# EAGLE design ArduPilot-v15 (EAGLE 5.04)

## Sheet 1 of 2
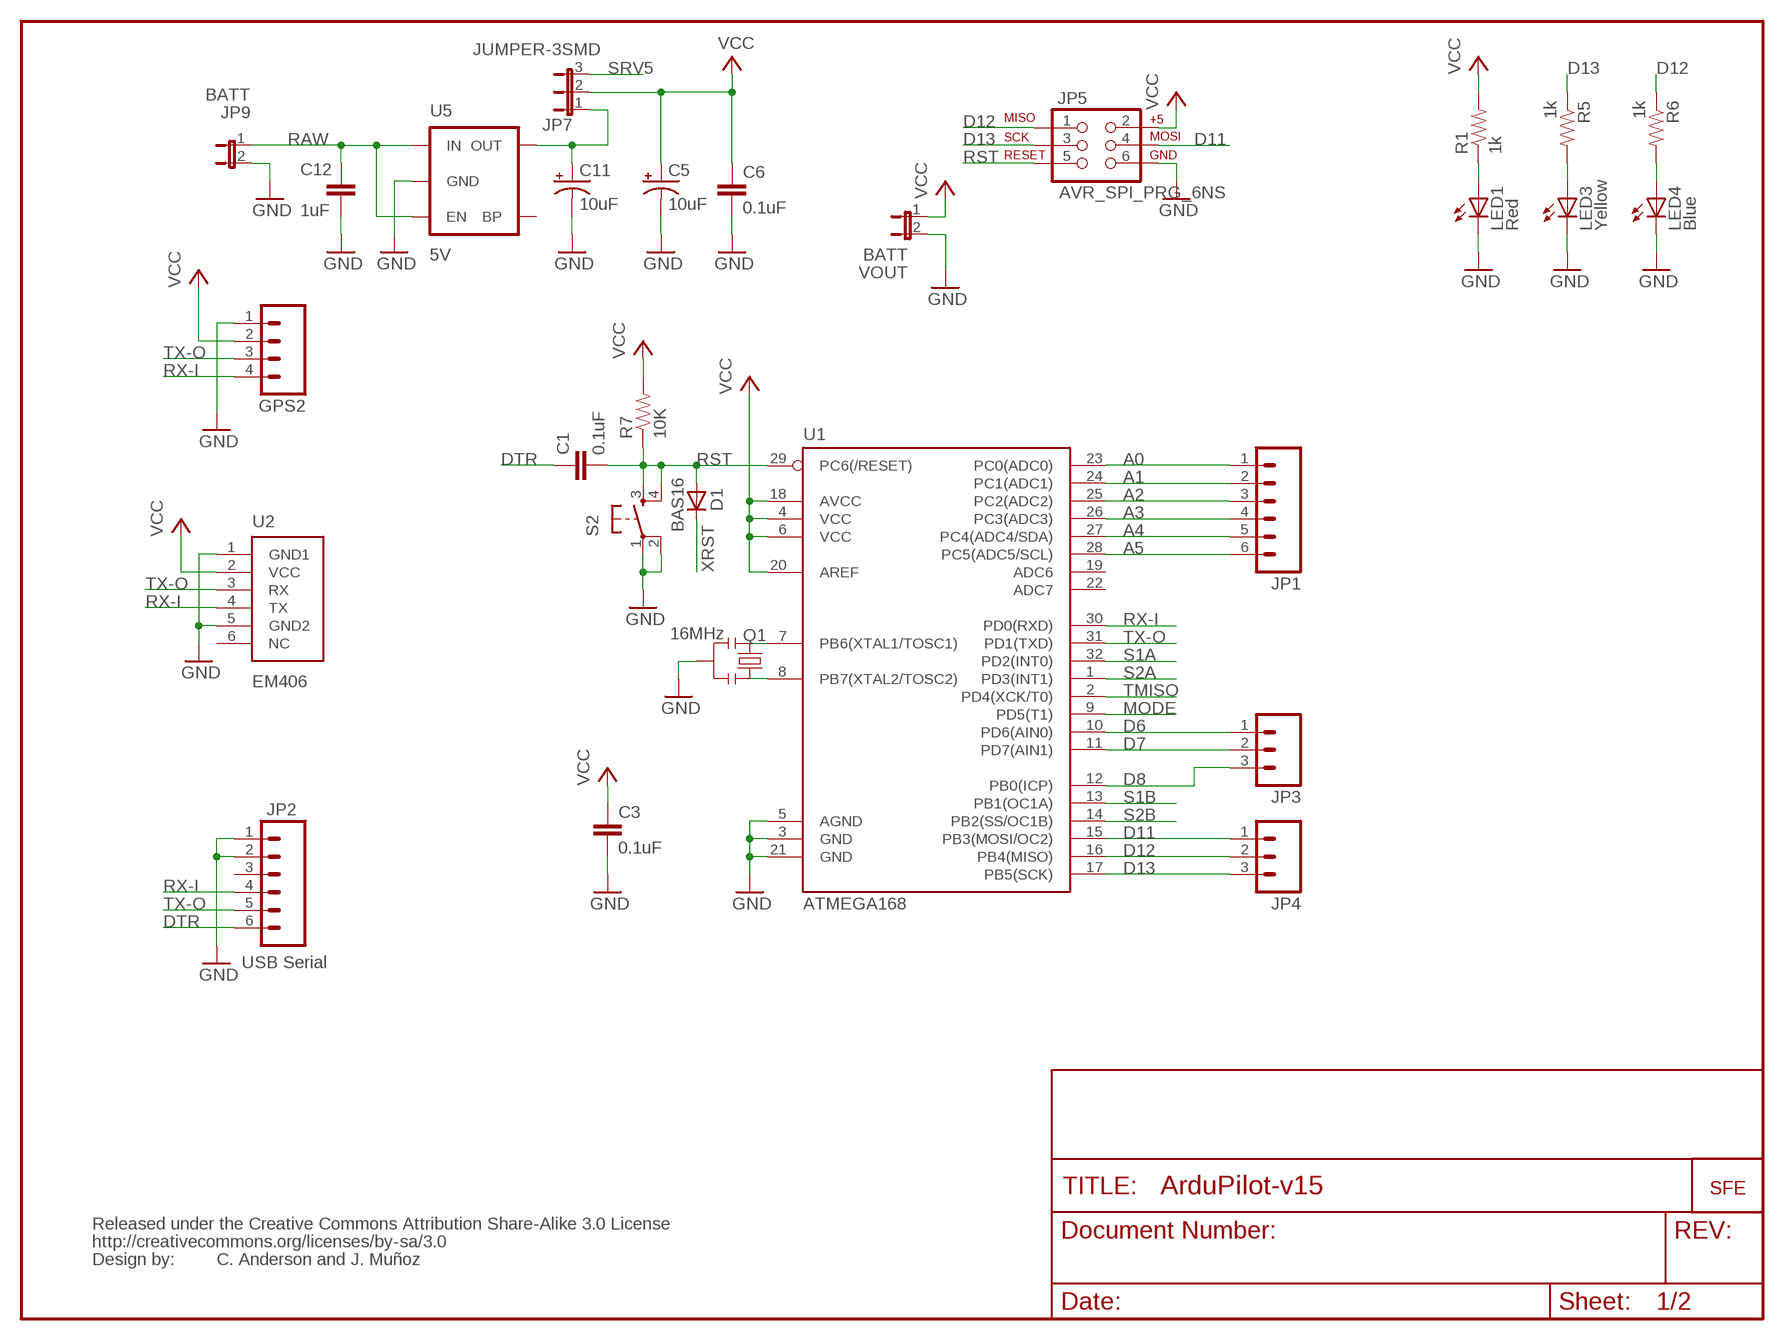
[diagram p0: schematic, sheet 1]

### Parts
C1  0.1uF  CAP0402  [C0402]
C3  0.1uF  CAP0402  [C0402]
C5  10uF  CAP_POL1206  [EIA3216]
C6  0.1uF  CAP0402  [C0402]
C11  10uF  CAP_POL1206  [EIA3216]
C12  1uF  CAP0402  [C0402]
D1  BAS16  DIODESOD  [SOD-323]
GPS2  M04PTH  [1X04]
JP1  M06SIP  [1X06]
JP2  USB Serial  M06SIP  [1X06]
JP3  M03PTH  [1X03]
JP4  M03PTH  [1X03]
JP5  AVR_SPI_PRG_6NS  [2X3-NS]
JP7  JUMPER-3SMD  [SJ_3]
JP9  BATT  JP1E  [1X02]
LED1  Red  LED0603  [LED-0603]
LED3  Yellow  LED0603  [LED-0603]
LED4  Blue  LED0603  [LED-0603]
Q1  16MHz  RESONATORSMD  [RESONATOR-SMD]
R1  1k  RESISTOR0402  [C0402]
R5  1k  RESISTOR0402  [C0402]
R6  1k  RESISTOR0402  [C0402]
R7  10K  RESISTOR0402  [C0402]
S2  TAC_SWITCHSMD  [TACTILE_SWITCH_SMD]
U1  ATMEGA168  [TQFP32-08]
U2  EM406  [EM406]
U5  5V  V_REG_LDOSMD  [SOT23-5]
U$1  LOGO-SFENEW  [SFE-NEW-WEBLOGO]
U$2  CREATIVE_COMMONS  [CREATIVE_COMMONS]
VOUT  BATT  JP1E  [1X02]

### Nets
A0: JP1.1 U1.23(PC0(ADC0))
A1: JP1.2 U1.24(PC1(ADC1))
A2: JP1.3 U1.25(PC2(ADC2))
A3: JP1.4 U1.26(PC3(ADC3))
A4: JP1.5 U1.27(PC4(ADC4/SDA))
A5: JP1.6 U1.28(PC5(ADC5/SCL))
D6: JP3.1 U1.10(PD6(AIN0))
D7: JP3.2 U1.11(PD7(AIN1))
D8: JP3.3 U1.12(PB0(ICP))
D11: JP4.1 JP5.4 U1.15(PB3(MOSI/OC2))
D12: JP4.2 JP5.1 R6.1 U1.16(PB4(MISO))
D13: JP4.3 JP5.3 R5.1 U1.17(PB5(SCK))
DTR: C1.1 JP2.6
GND: C3.2 C5.C(-) C6.2 C11.C(-) C12.2 GPS2.1 JP2.1 JP2.2 JP5.6 JP9.2 LED1.C LED3.C LED4.C Q1.2 S2.1 S2.2 U1.3(GND) U1.5(AGND) U1.21(GND) U2.1(GND1) U2.5(GND2) U5.2(GND) VOUT.2 ; also sheet 2
MODE: U1.9(PD5(T1)) ; also sheet 2
N$1: LED1.A R1.1
N$2: Q1.1 U1.7(PB6(XTAL1/TOSC1))
N$4: LED3.A R5.2
N$6: C11.A(+) JP7.1 U5.5(OUT)
N$8: LED4.A R6.2
N$9: Q1.3 U1.8(PB7(XTAL2/TOSC2))
RAW: C12.1 JP9.1 U5.1(IN) U5.3(EN)
RST: C1.2 D1.2(A) JP5.5 R7.1 S2.3 S2.4 U1.29(PC6(/RESET))
RX-I: GPS2.4 JP2.4 U1.30(PD0(RXD)) U2.4(TX)
S1A: U1.32(PD2(INT0)) ; also sheet 2
S1B: U1.13(PB1(OC1A)) ; also sheet 2
S2A: U1.1(PD3(INT1)) ; also sheet 2
S2B: U1.14(PB2(SS/OC1B)) ; also sheet 2
SRV5: JP7.3 ; also sheet 2
TMISO: U1.2(PD4(XCK/T0)) ; also sheet 2
TX-O: GPS2.3 JP2.5 U1.31(PD1(TXD)) U2.3(RX)
VCC: C3.1 C5.A(+) C6.1 GPS2.2 JP5.2 JP7.2 R1.2 R7.2 U1.4(VCC) U1.6(VCC) U1.18(AVCC) U1.20(AREF) U2.2(VCC) VOUT.1 ; also sheet 2
XRST: D1.1(C) ; also sheet 2
Unconnected: JP2.3 U1.19(ADC6) U1.22(ADC7) U2.6(NC) U5.4(BP)

### Notes on the sheet
- C. Anderson and J. Muñoz

## Sheet 2 of 2
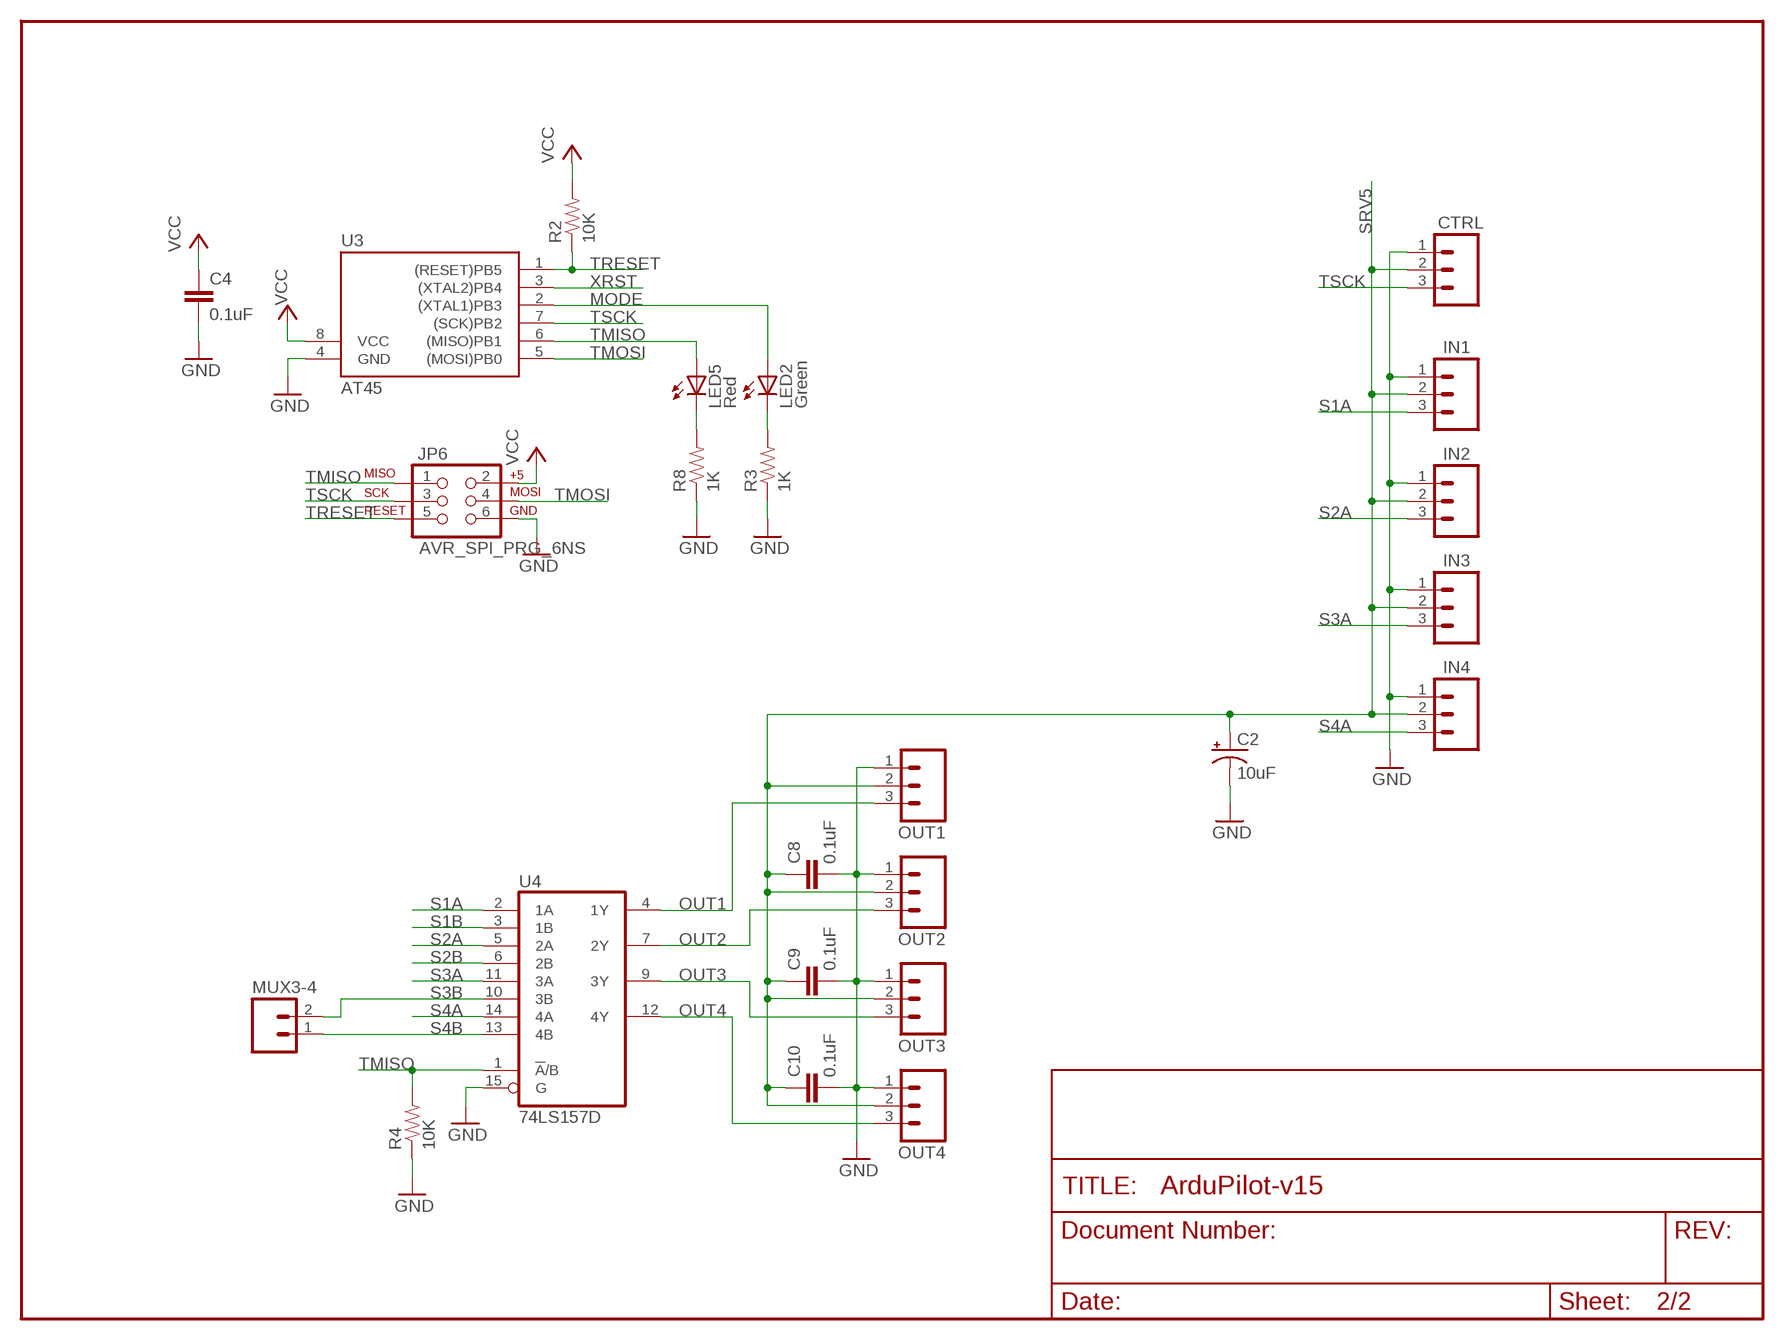
[diagram p1: schematic, sheet 2]

### Parts
C2  10uF  CAP_POL1206  [EIA3216]
C4  0.1uF  CAP0402  [C0402]
C8  0.1uF  CAP0402  [C0402]
C9  0.1uF  CAP0402  [C0402]
C10  0.1uF  CAP0402  [C0402]
CTRL  M03PTH  [1X03]
IN1  M03PTH  [1X03]
IN2  M03PTH  [1X03]
IN3  M03PTH  [1X03]
IN4  M03PTH  [1X03]
JP6  AVR_SPI_PRG_6NS  [2X3-NS]
LED2  Green  LED0603  [LED-0603]
LED5  Red  LED0603  [LED-0603]
MUX3-4  M02PTH  [1X02]
OUT1  M03PTH  [1X03]
OUT2  M03PTH  [1X03]
OUT3  M03PTH  [1X03]
OUT4  M03PTH  [1X03]
R2  10K  RESISTOR0402  [C0402]
R3  1K  RESISTOR0402  [C0402]
R4  10K  RESISTOR0402  [C0402]
R8  1K  RESISTOR0402  [C0402]
U3  AT45  TINY12S  [SOIC8]
U4  74LS157D  [SO16]

### Nets
GND: C2.C(-) C4.2 C8.2 C9.2 C10.2 CTRL.1 IN1.1 IN2.1 IN3.1 IN4.1 JP6.6 OUT1.1 OUT2.1 OUT3.1 OUT4.1 R3.1 R4.1 R8.1 U3.4(GND) U4.15(G) ; also sheet 1
MODE: LED2.A U3.2((XTAL1)PB3) ; also sheet 1
N$3: LED2.C R3.2
N$5: LED5.C R8.2
OUT1: OUT1.3 U4.4(1Y)
OUT2: OUT2.3 U4.7(2Y)
OUT3: OUT3.3 U4.9(3Y)
OUT4: OUT4.3 U4.12(4Y)
S1A: IN1.3 U4.2(1A) ; also sheet 1
S1B: U4.3(1B) ; also sheet 1
S2A: IN2.3 U4.5(2A) ; also sheet 1
S2B: U4.6(2B) ; also sheet 1
S3A: IN3.3 U4.11(3A)
S3B: MUX3-4.2 U4.10(3B)
S4A: IN4.3 U4.14(4A)
S4B: MUX3-4.1 U4.13(4B)
SRV5: C2.A(+) C8.1 C9.1 C10.1 CTRL.2 IN1.2 IN2.2 IN3.2 IN4.2 OUT1.2 OUT2.2 OUT3.2 OUT4.2 ; also sheet 1
TMISO: JP6.1 LED5.A R4.2 U3.6((MISO)PB1) U4.1(!A!/B) ; also sheet 1
TMOSI: JP6.4 U3.5((MOSI)PB0)
TRESET: JP6.5 R2.1 U3.1((RESET)PB5)
TSCK: CTRL.3 JP6.3 U3.7((SCK)PB2)
VCC: C4.1 JP6.2 R2.2 U3.8(VCC) ; also sheet 1
XRST: U3.3((XTAL2)PB4) ; also sheet 1

## Power pins joined to a net without a drawn wire
GND: U4.8(GND)
VCC: U4.16(VCC)

## Library data of the parts
C1 C3 C4 C6 C8-C10 C12 = SparkFun:CAP: Capacitor Standard 0603 ceramic capacitor, and 0.1" leaded capacitor.
C2 C5 C11 = SparkFun:CAP_POL: Capacitor Polarized These are standard SMD and PTH capacitors. Normally 10uF, 47uF, and 100uF in electrolytic and tantalum varieties. Always verify the external diameter of the through hole cap, it varies with capacity, voltage, and manufacturer. The EIA devices should be standard.
CTRL IN1-IN4 JP3 JP4 OUT1-OUT4 = SparkFun:M03: Header 3 Standard 3-pin 0.1" header. Use with straight break away headers (SKU : PRT-00116), right angle break away headers (PRT-00553), swiss pins (PRT-00743), machine pins (PRT-00117), and female headers (PRT-00115). Molex polarized connector foot print use with SKU : PRT-08232 with associated crimp pins and housings.
D1 = SparkFun:DIODE: Diode These are standard reverse protection diodes and small signal diodes. SMA package can handle up to about 1A. SOD-323 can handle about 200mA. What the SOD-323 package when ordering, there are some mfgs out there that are 5-pin packages.
GPS2 = SparkFun:M04: Header 4 Standard 4-pin 0.1" header. Use with straight break away headers (SKU : PRT-00116), right angle break away headers (PRT-00553), swiss pins (PRT-00743), machine pins (PRT-00117), and female headers (PRT-00115). Molex polarized connector foot print use with SKU : PRT-08231 with associated crimp pins and housings.
JP1 JP2 = SparkFun:M06: Header 6 Standard 6-pin 0.1" header. Use with straight break away headers (SKU : PRT-00116), right angle break away headers (PRT-00553), swiss pins (PRT-00743), machine pins (PRT-00117), and female headers (PRT-00115). Molex polarized connector foot print use with SKU : PRT-08094 with associated crimp pins and housings. NOTES ON THE VARIANTS LOCK and LOCK_LONGPADS... This footprint was designed to help hold the alignment of a through-hole component (i.e. 6-pin header) while soldering it into place. You may notice that each hole has been shifted either up or down by 0.005 of an inch from it's more standard position (which is a perfectly straight line). This slight alteration caused the pins (the squares in the middle) to touch the edges of the holes. Because they are alternating, it causes a "brace" to hold the component in place. 0.005 has proven to be the perfect amount of "off-center" position when using our standard breakaway headers. Although looks a little odd when you look at the bare footprint, once you have a header in there, the alteration is very hard to notice. Also, if you push a header all the way into place, it is covered up entirely on the bottom side. This idea of altering the position of holes to aid alignment will be further integrated into the Sparkfun Library for other footprints. It can help hold any component with 3 or more connection pins.
JP5 JP6 = SparkFun:AVR_SPI_PRG_6: AVR ISP 6 Pin This is the reduced ISP connector for AVR programming. Common on Arduino. This footprint will take up less PCB space and can be used with a 10-pin to 6-pin adapter such as SKU: BOB-08508
JP7 = SparkFun:JUMPER-3
JP9 VOUT = SparkFun:JP1E: Jumper Basic 0.1" spaced jumper. Use with breakaway headers.
LED1-LED5 = SparkFun:LED: LEDs Standard schematic elements and footprints for 5mm, 3mm, 1206, and 0603 sized LEDs. 5mm - Spark Fun Electronics SKU : COM-00529 (and others)
MUX3-4 = SparkFun:M02: Header 2 Standard 2-pin 0.1" header. Use with straight break away headers (SKU : PRT-00116), right angle break away headers (PRT-00553), swiss pins (PRT-00743), machine pins (PRT-00117), and female headers (PRT-00115). Molex polarized connector foot print use with SKU : PRT-08233 with associated crimp pins and housings.
Q1 = SparkFun:RESONATOR: Resonator Small SMD resonator. This is the itty bitty 10/20MHz resonators with built in caps. CSTCE10M0G55 and CSTCE20M0V53. Footprint has been reviewed closely but hasn't been tested yet.
R1-R8 = SparkFun:RESISTOR: Resistor Basic schematic elements and footprints for 0603, 1206, and PTH 1/10th watt (small) resistors.
S2 = SparkFun:TAC_SWITCH: Momentary Switch Button commonly used for reset or general input. Spark Fun Electronics SKU : COM-00097
U1 = SparkFun:ATMEGA168
U2 = SparkFun:EM406: EM406 Connector Proven layout and schematic for EM406 connector. Spark Fun Electronics SKU : GPS-00579
U3 = atmel:TINY12*: MICROCONTROLLER 1 Kbytes FLASH 64 bytes EEPROM
U4 = 74xx-us:74*157: Quadruple 2-line to 1-line data SELECTOR/MULTIPLEXER
U5 = SparkFun:V_REG_LDO: Voltage Regulator LDO Standard 150mA LDO voltage regulator in SOT-23 layout. Micrel part MIC5205. BP (by-pass) pin is used to lower output noise with 470pF cap.
U$1 = SparkFun:LOGO-SFE: Spark Fun Electronics PCB Logo This is the standard Spark Fun Electronics PCB logo.
U$2 = SparkFun:CREATIVE_COMMONS

## Board
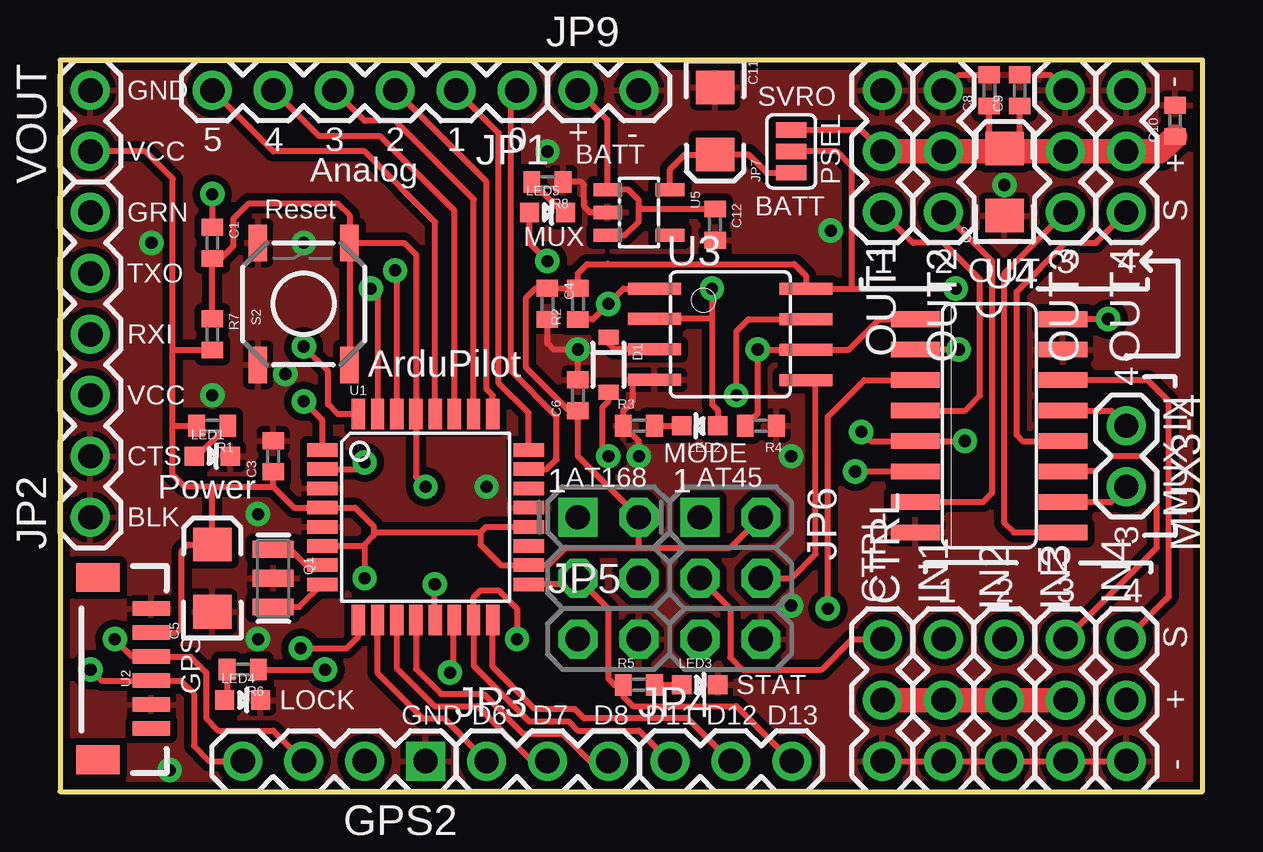
[diagram p2: board, top side]
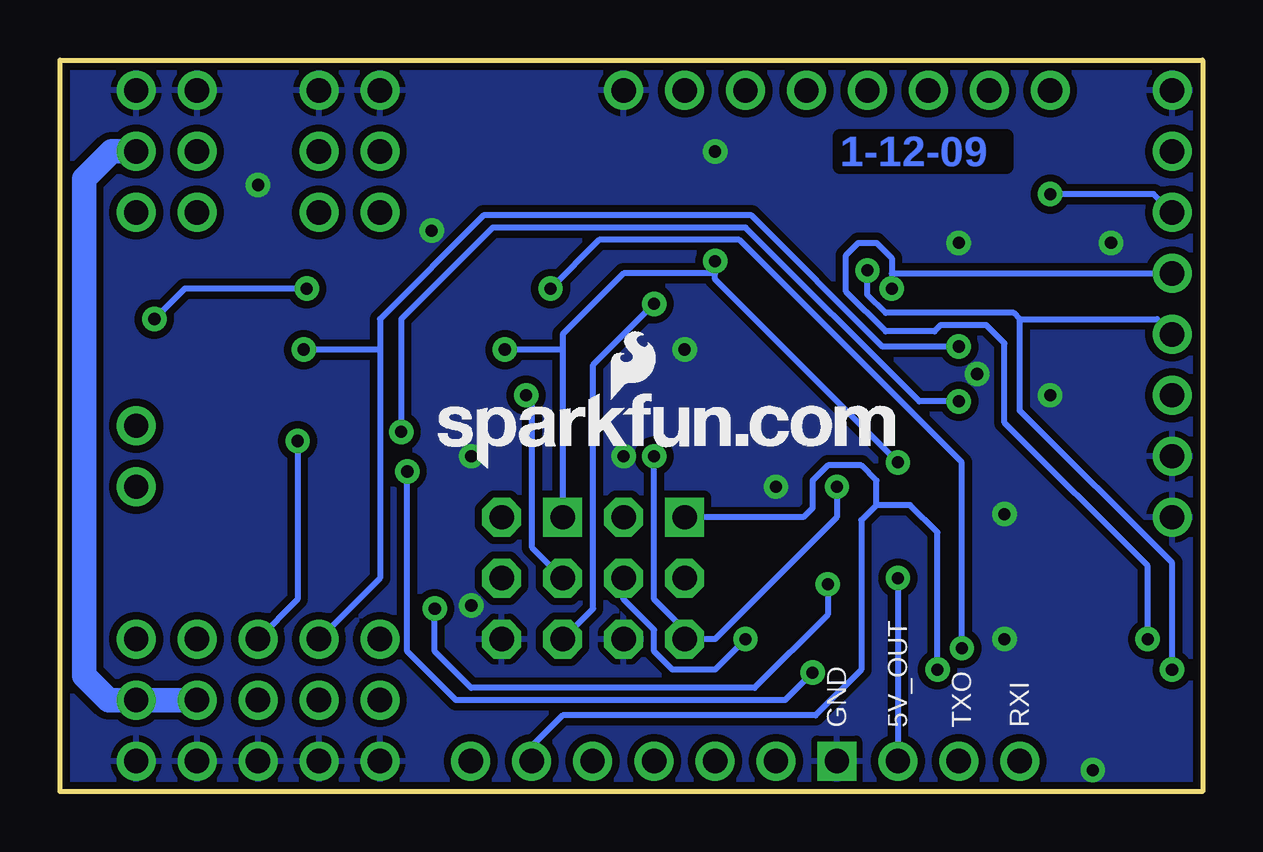
[diagram p3: board, bottom side, seen from below]

Size 47.62 x 30.48 mm. Coordinates in mm from the lower left corner, seen from the top.
Outline: 0,0 47.62,0 47.62,30.48 0,30.48 0,0
Copper layers (1*16): Top 0.035mm / dielectric 1.5mm / Bottom 0.035mm
Design rules "SparkFun": minimum track width 8mil, minimum drill 20mil, track to track 8mil, track to pad 8mil, pad to pad 8mil, via to via 8mil, smd to smd 8mil, copper to edge 10mil, drill to drill 8mil, minimum pad ring 12mil, minimum via ring 10mil, stop-mask expansion 4mil, vias tented up to drill 25mil, thermal gap 10mil

### Footprints (pad centres in the part's own frame; a part is rotated, then mirrored left to right if it is on the bottom)
C0402 = smd 0.7 x 0.9: 1 -0.65,0; 2 0.65,0
EIA3216 = smd 1.4 x 1.6: A 1.4,0; C -1.4,0
1X03 = drill 1.016 round: 1 0,0; 2 2.54,0; 3 5.08,0
SOD-323 = smd 0.63 x 0.83: 1 -1.15,0; 2 1.15,0
1X04 = drill 1.016 square: 1 0,0 | drill 1.016 round: 2 2.54,0; 3 5.08,0; 4 7.62,0
1X06 = drill 1.016 round: 1 0,0; 2 2.54,0; 3 5.08,0; 4 7.62,0; 5 10.16,0; 6 12.7,0
2X3-NS = drill 1.016 square: 1 -2.54,-1.27 | drill 1.016 octagon: 2 -2.54,1.27; 3 0,-1.27; 4 0,1.27; 5 2.54,-1.27; 6 2.54,1.27
SJ_3 = smd 0.635 x 1.27: 1 -0.889,0; 2 0,0; 3 0.889,0
1X02 = drill 1.016 round: 1 0,0; 2 2.54,0
LED-0603 = smd 0.8 x 0.8: A 0,-0.75; C 0,0.75
RESONATOR-SMD = smd 0.7 x 1.7: 1 -1.2,0; 2 0,0; 3 1.2,0
TACTILE_SWITCH_SMD = smd 1.524 x 0.762: 1 -2.54,1.905; 2 2.54,1.905; 3 -2.54,-1.905; 4 2.54,-1.905
TQFP32-08 = smd 1.27 x 0.559: 1 -4.293,2.8; 2 -4.293,2; 3 -4.293,1.2; 4 -4.293,0.4; 5 -4.293,-0.4; 6 -4.293,-1.2; 7 -4.293,-2; 8 -4.293,-2.8; 17 4.293,-2.8; 18 4.293,-2; 19 4.293,-1.2; 20 4.293,-0.4; 21 4.293,0.4; 22 4.293,1.2; 23 4.293,2; 24 4.293,2.8 | smd 0.559 x 1.27: 9 -2.8,-4.293; 10 -2,-4.293; 11 -1.2,-4.293; 12 -0.4,-4.293; 13 0.4,-4.293; 14 1.2,-4.293; 15 2,-4.293; 16 2.8,-4.293; 25 2.8,4.293; 26 2,4.293; 27 1.2,4.293; 28 0.4,4.293; 29 -0.4,4.293; 30 -1.2,4.293; 31 -2,4.293; 32 -2.8,4.293
EM406 = smd 0.6 x 1.55: 1 0,0; 2 1,0; 3 2,0; 4 3,0; 5 4,0; 6 5,0 | smd 1.2 x 1.8: P$1 -1.3,-2.225; P$2 6.3,-2.225
SOIC8 = smd 0.5 x 2.2: 1 -1.905,-3.154; 2 -0.645,-3.154; 3 0.625,-3.154; 4 1.895,-3.154; 5 1.905,3.154; 6 0.635,3.154; 7 -0.635,3.154; 8 -1.905,3.154
SO16 = smd 0.66 x 2.032: 1 -4.445,-3.073; 2 -3.175,-3.073; 3 -1.905,-3.073; 4 -0.635,-3.073; 5 0.635,-3.073; 6 1.905,-3.073; 7 3.175,-3.073; 8 4.445,-3.073; 9 4.445,3.073; 10 3.175,3.073; 11 1.905,3.073; 12 0.635,3.073; 13 -0.635,3.073; 14 -1.905,3.073; 15 -3.175,3.073; 16 -4.445,3.073
SOT23-5 = smd 0.55 x 1.2: 1 -0.95,-1.3; 2 0,-1.3; 3 0.95,-1.3; 4 0.95,1.3; 5 -0.95,1.3

### Placement (x,y rotation side)
C1  6.35,22.86 270 top
C2  39.37,25.4 90 top
C3  8.89,13.97 90 top
C4  20.32,20.32 270 top
C5  6.35,8.89 90 top
C6  21.59,16.51 90 top
C8  38.73,29.21 90 top
C9  40.01,29.21 90 top
C10  46.48,27.94 90 top
C11  27.3,27.94 270 top
C12  27.3,23.62 270 top
CTRL  34.29,1.27 90 top
D1  22.86,17.78 270 top
GPS2  15.24,1.27 180 top
IN1  36.83,1.27 90 top
IN2  39.37,1.27 90 top
IN3  41.91,1.27 90 top
IN4  44.45,1.27 90 top
JP1  19.05,29.21 180 top
JP2  1.27,11.43 90 top
JP3  17.78,1.27 0 top
JP4  25.43,1.27 0 top
JP5  22.86,8.89 270 top
JP6  27.94,8.89 270 top
JP7  30.48,26.67 90 top
JP9  21.59,29.21 0 top
LED1  6.35,13.97 270 top
LED2  26.67,15.24 90 top
LED3  26.67,4.45 270 top
LED4  7.62,3.81 270 top
LED5  20.32,24.13 270 top
MUX3-4  44.45,15.24 270 top
OUT1  34.29,29.21 270 top
OUT2  36.83,29.21 270 top
OUT3  41.91,29.21 270 top
OUT4  44.45,29.21 270 top
Q1  8.89,8.89 270 top
R1  6.35,15.24 180 top
R2  21.59,20.32 90 top
R3  24.13,15.24 0 top
R4  29.21,15.24 180 top
R5  24.13,4.45 0 top
R6  7.62,5.08 180 top
R7  6.35,19.05 270 top
R8  20.32,25.4 180 top
S2  10.16,20.32 90 top
U1  15.24,11.43 0 top
U2  3.81,7.62 270 top
U3  27.94,19.05 270 top
U4  38.73,15.24 270 top
U5  24.13,24.13 270 top
U$1  31.88,13.46 0 bottom
U$2  -10.16,-10.16 0 top  (outside the outline)
VOUT  1.27,26.67 90 top

### Tracks (layer width: path | path; a pad name or v marks a point on that pad's centre or on a via)
A0
  Top 0.254: U1.23 20.29,13.43 20.7,13.84 20.7,15.62 18.8,17.53 18.8,28.96 JP1.1
A1
  Top 0.254: U1.24 19.53,15.77 18.29,17.02 18.29,27.43 JP1.2
A2
  Top 0.254: U1.25 18.04,16.5 17.78,16.76 17.78,25.4 JP1.3
A3
  Top 0.254: U1.26 17.24,24.67 13.97,27.94 12.7,27.94 JP1.4
A4
  Top 0.254: U1.27 16.44,24.2 13.34,27.3 10.79,27.3 JP1.5
A5
  Top 0.254: U1.28 15.64,23.73 12.7,26.67 8.89,26.67 JP1.6
D6
  Top 0.254: U1.10 13.24,4.92 15.11,3.05 16,3.05 JP3.1
D7
  Top 0.254: U1.11 14.04,5.14 15.62,3.56 17.4,3.56 19.68,1.27 JP3.2
D8
  Top 0.254: U1.12 14.84,5.1 15.88,4.06 17.65,4.06 19.3,2.41 20.95,2.41 22.1,1.27 JP3.3
D11  (via drill 0.51)
  Top 0.254: JP4.1 25.4,1.27 24.13,2.54 21.59,2.54 21.21,2.92 19.56,2.92 17.25,5.23 17.25,7.11 | U1.15 17.25,7.11 | 17.25,7.11 17.27,7.11 U1.15 | U1.15 17.24,8.1 17.53,8.38 18.29,8.38 19.05,7.62 v19.05,6.35
  Bottom 0.254: JP5.4 24.13,8 22.86,6.73 22.86,5.84 22.1,5.08 20.32,5.08 v19.05,6.35
D12  (via drill 0.51)
  Top 0.254: U1.16 18.04,7.23 18.03,7.24 18.03,5.21 19.81,3.43 21.46,3.43 21.84,3.05 26.16,3.05 27.94,1.27 JP4.2 | R6.1 v11.05,5.08
  Bottom 0.254: JP5.1 16.64,11.43 16.26,11.81 16.26,12.95 15.62,13.59 14.22,13.59 13.59,12.95 13.59,11.94 | JP4.2 27.96,1.88 26.67,3.17 16.13,3.17 14.22,5.08 14.22,11.3 13.59,11.94 | v11.05,5.08 11.05,10.79 12.19,11.94 13.59,11.94
D13
  Top 0.254: JP4.3 30.48,1.27 28.19,3.56 23.88,3.56 23.48,3.95 R5.1 23.11,4.45 22.86,4.7 22.86,7.62 JP5.3 21.33,8.63 U1.17
DTR  (via drill 0.51)
  Top 0.254: v6.35,24.89 C1.1
  Bottom 0.254: v6.35,24.89 2.03,24.89 JP2.6
GND  (via drill 0.51)
  Top 0.254: 20.32,19.68 C4.2 20.32,18.67 20.57,18.41 v21.59,18.41 21.59,17.14 | IN4.1 IN3.1 IN2.1 IN1.1 CTRL.1 | 21.59,17.14 C6.2 | U3.4 23.87,17.16 23.88,17.14 23.88,16.26 23.48,15.86 R3.1 23.5,15.24 24.13,14.61 v24.13,13.97 | C6.2 21.59,17.14 | C8.2 37.48,29.86 OUT2.1 | OUT3.1 41.27,29.84 40.64,29.84 | U5.2 22.1,24.13 21.84,24.38 21.84,25.27 21.72,25.4 R8.1
  other vias: 4.57,0.89 6.35,16.51 30.48,13.97 30.48,7.75 17.78,12.7 9.4,17.4 8.26,11.56 10.16,22.86 3.81,22.86 8.26,6.35 39.37,25.27 32.13,23.37 20.32,26.67
  pour Top (isolate 0.305): 0,0 0,30.48 48.26,30.48 48.26,0
  pour Bottom (isolate 0.305): 0,0 0,30.48 48.26,30.48 48.26,0
MODE  (via drill 0.51)
  Top 0.254: U1.9 12.44,6.47 11.94,5.97 v10.03,5.97 | U3.2 27.18,19.7 27.18,19.68 | LED2.A 27.42,15.89 27.18,16.13 27.18,19.68 | v27.18,20.95 27.18,19.68
  Bottom 0.254: v10.03,5.97 10.03,13.72 19.3,22.99 25.15,22.99 v27.18,20.95
N$1
  Top 0.254: LED1.A 5.71,13.97 6.99,15.24 R1.1
N$2
  Top 0.254: U1.7 10.26,9.43 9.6,10.09 Q1.1
N$3
  Top 0.254: R3.2 LED2.C
N$4
  Top 0.254: R5.2 LED3.A
N$5
  Top 0.254: LED5.C 20.94,24.13 R8.2
N$6
  Top 0.254: U5.5 25.43,25.94 26.03,26.54 C11.A 28.7,26.54 29.46,25.78 JP7.1
N$8
  Top 0.254: R6.2 6.99,5.08 6.99,3.81 LED4.A
N$9
  Top 0.254: U1.8 10.93,8.63 10.92,8.64 9.98,7.69 Q1.3
OUT1
  Top 0.254: 35.56,15.88 U4.4 37.72,15.88 38.35,16.51 38.35,21.34 36.83,22.86 35.56,22.86 OUT1.3
OUT2
  Top 0.254: U4.7 38.48,12.06 38.86,12.45 38.86,22.1 OUT2.3
OUT3
  Top 0.254: U4.9 39.75,10.79 39.37,11.18 39.37,21.59 OUT3.3
OUT4
  Top 0.254: U4.12 40.13,14.61 39.88,14.86 39.88,20.83 41.91,22.86 43.18,22.86 OUT4.3
RAW
  Top 0.254: JP9.1 22.83,27.97 U5.1 23.69,25.08 24.13,24.64 24.13,24.38 | U5.3 23.56,23.18 24.13,23.75 24.13,24.38 | C12.1 24.24,24.27 24.13,24.38
RST  (via drill 0.51)
  Top 0.254: C1.2 6.35,22.23 | 6.35,19.56 R7.1 C1.2 | S2.4 S2.3 | S2.4 14.35,22.86 14.84,22.37 U1.29 14.84,13.1 v15.24,12.7 | C1.2 6.72,22.21 7.24,22.73 7.24,23.88 7.87,24.51 11.56,24.51 12.06,24 S2.4 | D1.2 22.86,16.26 22.61,16 22.61,14.22 v22.86,13.97
  Bottom 0.254: v22.86,13.97 22.86,8 21.59,6.73 JP5.5 20.32,6.35 15.24,11.43 v15.24,12.7
RX-I  (via drill 0.51)
  Top 0.254: v1.27,5.08 1.73,4.62 U2.4 5.03,4.62 5.59,4.06 5.59,1.91 6.22,1.27 GPS2.4 | U1.30 14.04,21.52 v13.97,21.72
  Bottom 0.254: v13.97,21.72 13.97,20.7 13.21,19.94 7.87,19.94 7.62,19.68 | v1.27,5.08 1.27,9.53 7.62,15.88 7.62,19.68 | 7.62,19.68 1.91,19.68 JP2.4
S1A  (via drill 0.51)
  Top 0.254: v37.47,18.41 U4.2 | U1.32 11.58,15.72 11.18,16.13 11.18,17.53 v10.16,18.54
  Bottom 0.254: 34.29,18.41 v37.47,18.41 | 34.29,18.41 34.29,8.89 IN1.3 | v10.16,18.54 13.34,18.54 18.8,24 29.97,24 34.29,19.68 34.29,18.41
S1B  (via drill 0.51)
  Top 0.254: U1.13 15.62,7.11 v15.62,8.64 | U4.3 33.53,17.14 32,15.62 32,9.27 v32,7.62
  Bottom 0.254: v15.62,8.64 15.62,7.37 18.67,4.32 30.48,4.32 32,5.84 v32,7.62
S2A  (via drill 0.51)
  Top 0.254: v37.72,14.61 U4.5 33.78,14.61 v33.4,14.99 | U1.1 10.95,15.47 v10.16,16.26
  Bottom 0.254: v37.72,14.61 37.72,8 IN2.3 | v10.16,16.26 11.81,16.26 19.05,23.5 29.59,23.5 33.4,19.68 v33.4,14.99
S2B  (via drill 0.51)
  Top 0.254: v33.15,13.34 U4.6 | U1.14 16.41,7.14 16.41,5.11 v16.26,4.95
  Bottom 0.254: v33.15,13.34 33.15,5.84 31.11,3.81 17.4,3.81 v16.26,4.95
S3A
  Top 0.254: 41.02,13.34 U4.11 43.18,13.34 43.81,13.97 45.09,13.97 45.72,13.34 45.72,10.16 IN3.3
S3B
  Top 0.254: U4.10 43.81,12.06 MUX3-4.2
S4A
  Top 0.254: IN4.3 46.1,8 | 46.1,8 46.15,8.05 | 46.1,8 46.23,8.13 46.23,16.26 45.34,17.14 U4.14
S4B
  Top 0.254: 41.66,15.88 U4.13 43.81,15.88 MUX3-4.1
SRV5
  Top 0.254: 40.01,26.67 C9.1 | 38.73,26.67 C8.1 | C2.A 38.99,26.8 38.86,26.67 | OUT1.2 33.4,27.56 JP7.3
  Top 1.016: OUT1.2 OUT2.2 38.73,26.67 38.86,26.67 40.01,26.67 OUT3.2 OUT4.2 45.85,26.67 C10.1 | CTRL.2 IN1.2 IN2.2 IN3.2
  Bottom 1.016: OUT4.2 45.47,26.67 46.61,25.53 46.61,4.83 45.59,3.81 IN4.2 IN3.2
TMISO  (via drill 0.51)
  Top 0.254: U1.2 12.41,13.43 v12.7,13.72 | U4.1 34.16,19.68 32.89,18.41 U3.6 v29.08,18.41 29.08,15.75 28.57,15.24 R4.2 | LED5.A 19.57,22.85 v20.32,22.1
  Bottom 0.254: v12.7,13.72 20.32,21.34 20.32,21.59 | 20.32,21.59 v20.32,22.1 | 26.67,18.41 26.67,19.05 24.13,21.59 20.32,21.59 | 26.67,18.41 JP6.1 | 26.67,18.41 v29.08,18.41
TMOSI
  Top 0.254: 30.99,17.02 U3.5 31.37,17.14 31.5,17.02 31.5,9.91 30.48,8.89 JP6.4
TRESET  (via drill 0.51)
  Top 0.254: U3.1 23.5,20.95 v22.86,20.32 22.21,19.67 R2.1
  Bottom 0.254: JP6.5 25.4,7.62 25.4,17.78 v22.86,20.32
TSCK  (via drill 0.51)
  Top 0.254: v28.19,16.51 28.19,19.18 28.7,19.68 U3.7 | JP6.3 27.94,7.62 27.94,5.59 28.45,5.08 31.75,5.08 33.02,6.35 CTRL.3
  Bottom 0.254: JP6.3 27.94,10.16 27.94,16.26 v28.19,16.51
TX-O  (via drill 0.51)
  Top 0.254: U1.31 13.24,20.67 v12.95,20.95 | GPS2.3 8.89,2.54 6.6,2.54 6.1,3.05 6.1,4.95 5.43,5.62 3.9,5.62 3.81,5.71 U2.3 3.02,5.62 v2.29,6.35
  Bottom 0.254: v2.29,6.35 2.29,9.4 8.26,15.37 8.26,18.67 9.02,19.43 10.92,19.43 11.18,19.18 13.21,19.18 14.86,20.83 14.86,22.35 14.35,22.86 13.59,22.86 12.95,22.23 12.95,21.59 | 12.95,21.59 v12.95,20.95 | 12.95,21.59 JP2.5
VCC  (via drill 0.51)
  Top 0.254: U2.2 4.84,6.62 5.08,6.86 5.08,10.03 5.33,10.29 C5.A | R7.2 6.35,18.41 4.7,18.41 | 24.13,10.16 JP5.2 21.59,13.97 21.59,15.49 21.46,15.62 | 24.13,10.16 21.08,10.16 20.35,9.43 U1.18 18.38,9.43 17.53,10.29 17.53,10.79 | v43.69,19.68 U4.16 | VOUT.1 3.56,26.67 4.7,25.53 4.7,18.41 | 24.13,10.16 27.94,10.16 JP6.2 | 33.02,20.95 U3.8 31.09,21.48 30.61,21.97 22.86,21.97 | 33.02,20.95 v37.34,20.95 | R2.2 21.59,20.95 | R2.2 21.59,21.59 21.97,21.97 22.86,21.97 | C4.1 20.21,20.97 20.19,20.95 | C4.1 R2.2 | C4.1 20.32,20.95 19.81,20.95 19.43,20.57 19.43,17.65 21.46,15.62 | 8.89,12.7 9.76,11.83 U1.4 12.3,11.83 13.08,11.05 13.08,10.79 | 6.35,12.7 8.89,12.7 | 6.35,12.7 5.21,12.7 4.7,13.21 4.7,15.24 | 4.7,15.24 4.7,18.41 | 4.7,15.24 R1.2 | 8.89,12.7 C3.1 | 12.7,10.23 U1.6 | U1.20 17.76,11.03 17.53,10.79 | 13.08,10.79 17.53,10.79 | 12.7,10.23 v12.7,8.89 | 13.08,10.79 13.08,10.67 12.7,10.29 12.7,10.23 | 22.86,21.97 22.83,22 | C5.A 6.35,12.7 | C5.A | 33.02,20.95 33.02,26.04 32.38,26.67 JP7.2 | C6.1 21.59,15.75 21.46,15.62
  Bottom 0.254: v12.7,8.89 GPS2.2 | v37.34,20.95 42.42,20.95 v43.69,19.68
XRST
  Top 0.254: D1.1 22.86,18.67 23.1,18.43 U3.3

### Text on the board
Bottom: 1-12-09
tPlace: GND | SVRO | - | 5 | 4 | 3 | 2 | 1 | 0 | + | - | VCC | BATT | + | Analog | PSEL | GRN | Reset | BATT | S | MUX | 1 | 2 | 3 | 4 | TXO | OUT | RXI | ArduPilot | 4 | VCC | CTS | MODE | AT168 | AT45 | Power | 1 | 1 | BLK | MUX IN | 3 | IN | CTRL | 1 | 2 | 3 | 4 | S | GPS | STAT | LOCK | GND | D6 | D7 | D8 | D11 | D12 | D13 | + | - | C. Anderson and J. Muñoz
bPlace: RXI | TXO | 5V_OUT | GND